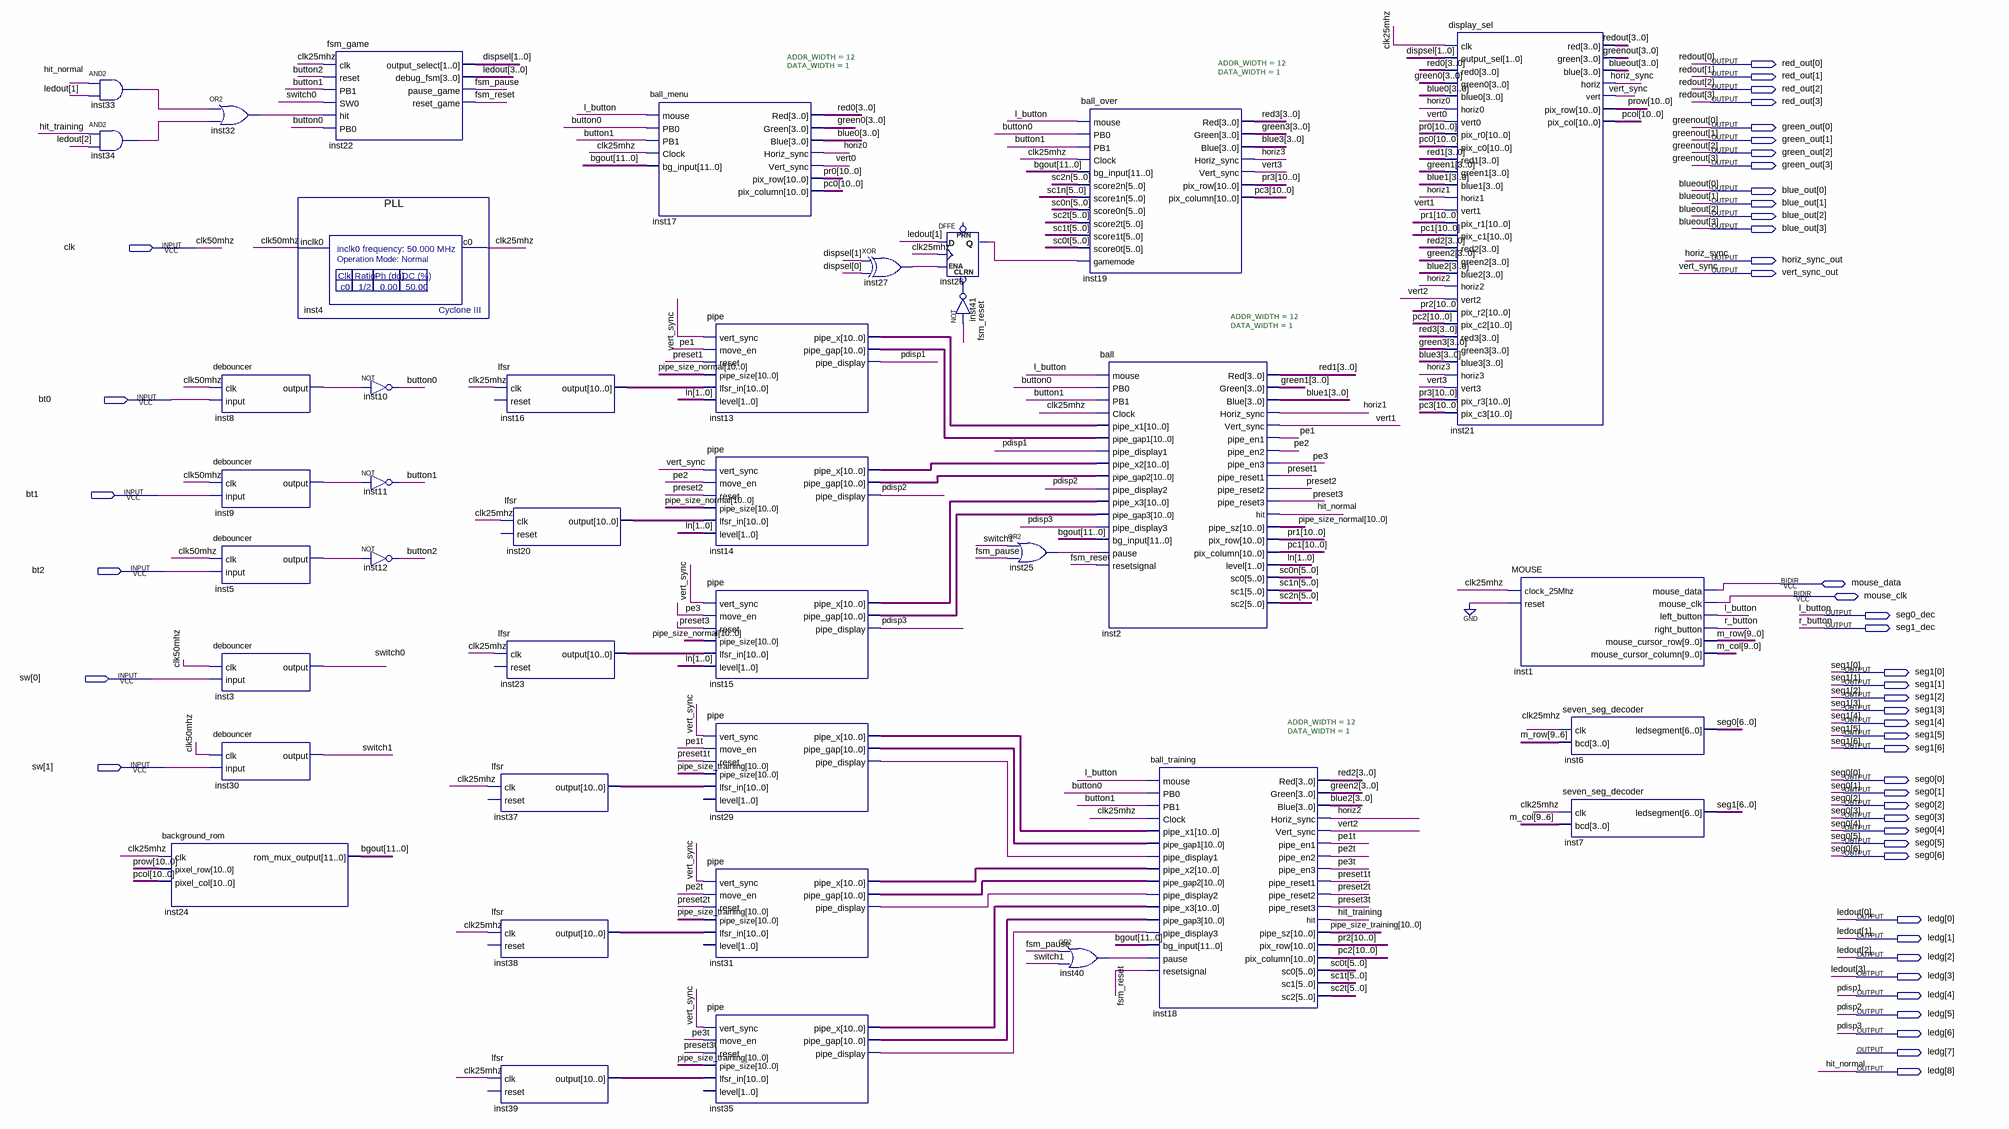
[diagram p0: schematic sheet]
// Quartus schematic flabbybird.bdf as structural Verilog: 39 symbols, 47 pins
module flabbybird (
  input  clk,
  input  bt0,
  input  bt1,
  input  bt2,
  input  [1:0] sw,
  inout  mouse_data,
  inout  mouse_clk,
  output [3:0] red_out,
  output [3:0] green_out,
  output [3:0] blue_out,
  output horiz_sync_out,
  output vert_sync_out,
  output seg0_dec,
  output seg1_dec,
  output [6:0] seg1,
  output [6:0] seg0,
  output [8:0] ledg
);

  wire button0, button1, button2, clk25mhz, fsm_pause, fsm_reset, hit_training, horiz0, horiz1, horiz2,
       horiz3, inst5_output, inst8_output, inst9_output, inst25_out, inst26_q, inst27_out,
       inst29_pipe_display, inst31_pipe_display, inst32_out, inst33_out, inst34_out, inst35_pipe_display,
       inst40_out, inst41_out, pe1, pe1t, pe2, pe2t, pe3, pe3t, preset1, preset1t, preset2, preset2t,
       preset3, preset3t, switch0, switch1, vert0, vert1, vert2, vert3;
  wire [1:0] dispsel, ln;
  wire [3:0] blue0, blue1, blue2, blue3, green0, green1, green2, green3, red0, red1, red2, red3;
  wire [5:0] sc0n, sc0t, sc1n, sc1t, sc2n, sc2t;
  wire [9:0] m_col, m_row;
  wire [10:0] inst13_pipe_gap, inst13_pipe_x, inst14_pipe_gap, inst14_pipe_x, inst15_pipe_gap, inst15_pipe_x,
       inst16_output, inst20_output, inst23_output, inst29_pipe_gap, inst29_pipe_x, inst31_pipe_gap,
       inst31_pipe_x, inst35_pipe_gap, inst35_pipe_x, inst37_output, inst38_output, inst39_output, pc0, pc1,
       pc2, pc3, pcol, pipe_size_normal, pipe_size_training, pr0, pr1, pr2, pr3, prow;
  wire [11:0] bgout;

  and inst33 (inst33_out, ledg[8], ledg[1]);
  and inst34 (inst34_out, hit_training, ledg[2]);
  background_rom inst24 (.clk(clk25mhz), .pixel_row(prow), .pixel_col(pcol), .rom_mux_output(bgout));
  or inst32 (inst32_out, inst33_out, inst34_out);
  debouncer inst8 (.clk(clk), .\input (bt0), .\output (inst8_output));
  debouncer inst9 (.clk(clk), .\input (bt1), .\output (inst9_output));
  debouncer inst5 (.clk(clk), .\input (bt2), .\output (inst5_output));
  debouncer inst3 (.clk(clk), .\input (sw[0]), .\output (switch0));
  debouncer inst30 (.clk(clk), .\input (sw[1]), .\output (switch1));
  fsm_game inst22 (
    .clk(clk25mhz), .reset(button2), .PB1(button1), .SW0(switch0), .hit(inst32_out), .PB0(button0),
    .output_select(dispsel), .debug_fsm(ledg[3:0]), .pause_game(fsm_pause), .reset_game(fsm_reset));
  PLL inst4 (.inclk0(clk), .c0(clk25mhz));
  not inst10 (button0, inst8_output);
  not inst11 (button1, inst9_output);
  not inst12 (button2, inst5_output);
  lfsr inst37 (.clk(clk25mhz), .\output (inst37_output));  // open: reset
  lfsr inst38 (.clk(clk25mhz), .\output (inst38_output));  // open: reset
  lfsr inst39 (.clk(clk25mhz), .\output (inst39_output));  // open: reset
  lfsr inst16 (.clk(clk25mhz), .\output (inst16_output));  // open: reset
  lfsr inst20 (.clk(clk25mhz), .\output (inst20_output));  // open: reset
  lfsr inst23 (.clk(clk25mhz), .\output (inst23_output));  // open: reset
  ball_menu #(.ADDR_WIDTH(12), .DATA_WIDTH(1)) inst17 (
    .mouse(seg0_dec), .PB0(button0), .PB1(button1), .Clock(clk25mhz), .bg_input(bgout), .Red(red0),
    .Green(green0), .Blue(blue0), .Horiz_sync(horiz0), .Vert_sync(vert0), .pix_row(pr0), .pix_column(pc0));
  pipe inst13 (
    .vert_sync(vert_sync_out), .move_en(pe1), .reset(preset1), .pipe_size(pipe_size_normal),
    .lfsr_in(inst16_output), .level(ln), .pipe_x(inst13_pipe_x), .pipe_gap(inst13_pipe_gap),
    .pipe_display(ledg[4]));
  pipe inst14 (
    .vert_sync(vert_sync_out), .move_en(pe2), .reset(preset2), .pipe_size(pipe_size_normal),
    .lfsr_in(inst20_output), .level(ln), .pipe_x(inst14_pipe_x), .pipe_gap(inst14_pipe_gap),
    .pipe_display(ledg[5]));
  pipe inst15 (
    .vert_sync(vert_sync_out), .move_en(pe3), .reset(preset3), .pipe_size(pipe_size_normal),
    .lfsr_in(inst23_output), .level(ln), .pipe_x(inst15_pipe_x), .pipe_gap(inst15_pipe_gap),
    .pipe_display(ledg[6]));
  pipe inst29 (
    .vert_sync(vert_sync_out), .move_en(pe1t), .reset(preset1t), .pipe_size(pipe_size_training),
    .lfsr_in(inst37_output), .pipe_x(inst29_pipe_x), .pipe_gap(inst29_pipe_gap),
    .pipe_display(inst29_pipe_display));  // open: level
  pipe inst31 (
    .vert_sync(vert_sync_out), .move_en(pe2t), .reset(preset2t), .pipe_size(pipe_size_training),
    .lfsr_in(inst38_output), .pipe_x(inst31_pipe_x), .pipe_gap(inst31_pipe_gap),
    .pipe_display(inst31_pipe_display));  // open: level
  pipe inst35 (
    .vert_sync(vert_sync_out), .move_en(pe3t), .reset(preset3t), .pipe_size(pipe_size_training),
    .lfsr_in(inst39_output), .pipe_x(inst35_pipe_x), .pipe_gap(inst35_pipe_gap),
    .pipe_display(inst35_pipe_display));  // open: level
  xor inst27 (inst27_out, dispsel[1], dispsel[0]);
  DFFE inst26 (.CLRN(inst41_out), .D(ledg[1]), .CLK(clk25mhz), .ENA(inst27_out), .Q(inst26_q));  // open: PRN
  not inst41 (inst41_out, fsm_reset);
  or inst25 (inst25_out, switch1, fsm_pause);
  ball_over #(.ADDR_WIDTH(12), .DATA_WIDTH(1)) inst19 (
    .mouse(seg0_dec), .PB0(button0), .PB1(button1), .Clock(clk25mhz), .bg_input(bgout), .score2n(sc2n),
    .score1n(sc1n), .score0n(sc0n), .score2t(sc2t), .score1t(sc1t), .score0t(sc0t), .gamemode(inst26_q),
    .Red(red3), .Green(green3), .Blue(blue3), .Horiz_sync(horiz3), .Vert_sync(vert3), .pix_row(pr3),
    .pix_column(pc3));
  ball #(.ADDR_WIDTH(12), .DATA_WIDTH(1)) inst2 (
    .mouse(seg0_dec), .PB0(button0), .PB1(button1), .Clock(clk25mhz), .pipe_x1(inst13_pipe_x),
    .pipe_gap1(inst13_pipe_gap), .pipe_display1(ledg[4]), .pipe_x2(inst14_pipe_x),
    .pipe_gap2(inst14_pipe_gap), .pipe_display2(ledg[5]), .pipe_x3(inst15_pipe_x),
    .pipe_gap3(inst15_pipe_gap), .pipe_display3(ledg[6]), .bg_input(bgout), .pause(inst25_out),
    .resetsignal(fsm_reset), .Red(red1), .Green(green1), .Blue(blue1), .Horiz_sync(horiz1),
    .Vert_sync(vert1), .pipe_en1(pe1), .pipe_en2(pe2), .pipe_en3(pe3), .pipe_reset1(preset1),
    .pipe_reset2(preset2), .pipe_reset3(preset3), .hit(ledg[8]), .pipe_sz(pipe_size_normal), .pix_row(pr1),
    .pix_column(pc1), .level(ln), .sc0(sc0n), .sc1(sc1n), .sc2(sc2n));
  or inst40 (inst40_out, fsm_pause, switch1);
  ball_training #(.ADDR_WIDTH(12), .DATA_WIDTH(1)) inst18 (
    .mouse(seg0_dec), .PB0(button0), .PB1(button1), .Clock(clk25mhz), .pipe_x1(inst29_pipe_x),
    .pipe_gap1(inst29_pipe_gap), .pipe_display1(inst29_pipe_display), .pipe_x2(inst31_pipe_x),
    .pipe_gap2(inst31_pipe_gap), .pipe_display2(inst31_pipe_display), .pipe_x3(inst35_pipe_x),
    .pipe_gap3(inst35_pipe_gap), .pipe_display3(inst35_pipe_display), .bg_input(bgout), .pause(inst40_out),
    .resetsignal(fsm_reset), .Red(red2), .Green(green2), .Blue(blue2), .Horiz_sync(horiz2),
    .Vert_sync(vert2), .pipe_en1(pe1t), .pipe_en2(pe2t), .pipe_en3(pe3t), .pipe_reset1(preset1t),
    .pipe_reset2(preset2t), .pipe_reset3(preset3t), .hit(hit_training), .pipe_sz(pipe_size_training),
    .pix_row(pr2), .pix_column(pc2), .sc0(sc0t), .sc1(sc1t), .sc2(sc2t));
  display_sel inst21 (
    .clk(clk25mhz), .output_sel(dispsel), .red0(red0), .green0(green0), .blue0(blue0), .horiz0(horiz0),
    .vert0(vert0), .pix_r0(pr0), .pix_c0(pc0), .red1(red1), .green1(green1), .blue1(blue1), .horiz1(horiz1),
    .vert1(vert1), .pix_r1(pr1), .pix_c1(pc1), .red2(red2), .green2(green2), .blue2(blue2), .horiz2(horiz2),
    .vert2(vert2), .pix_r2(pr2), .pix_c2(pc2), .red3(red3), .green3(green3), .blue3(blue3), .horiz3(horiz3),
    .vert3(vert3), .pix_r3(pr3), .pix_c3(pc3), .red(red_out), .green(green_out), .blue(blue_out),
    .horiz(horiz_sync_out), .vert(vert_sync_out), .pix_row(prow), .pix_col(pcol));
  MOUSE inst1 (
    .clock_25Mhz(clk25mhz), .reset(1'b0), .left_button(seg0_dec), .right_button(seg1_dec),
    .mouse_cursor_row(m_row), .mouse_cursor_column(m_col), .mouse_data(mouse_data), .mouse_clk(mouse_clk));
  seven_seg_decoder inst6 (.clk(clk25mhz), .bcd(m_row[9:6]), .ledsegment(seg0));
  seven_seg_decoder inst7 (.clk(clk25mhz), .bcd(m_col[9:6]), .ledsegment(seg1));

  // Other names for the same wires on the sheet: blueout[3:0] = blue_out; clk50mhz = clk; greenout[3:0] = green_out;
  //   hit_normal = ledg[8]; horiz_sync = horiz_sync_out; l_button = seg0_dec; ledout[3:0] = ledg[3:0];
  //   pdisp1 = ledg[4]; pdisp2 = ledg[5]; pdisp3 = ledg[6]; r_button = seg1_dec; redout[3:0] = red_out;
  //   vert_sync = vert_sync_out
endmodule
